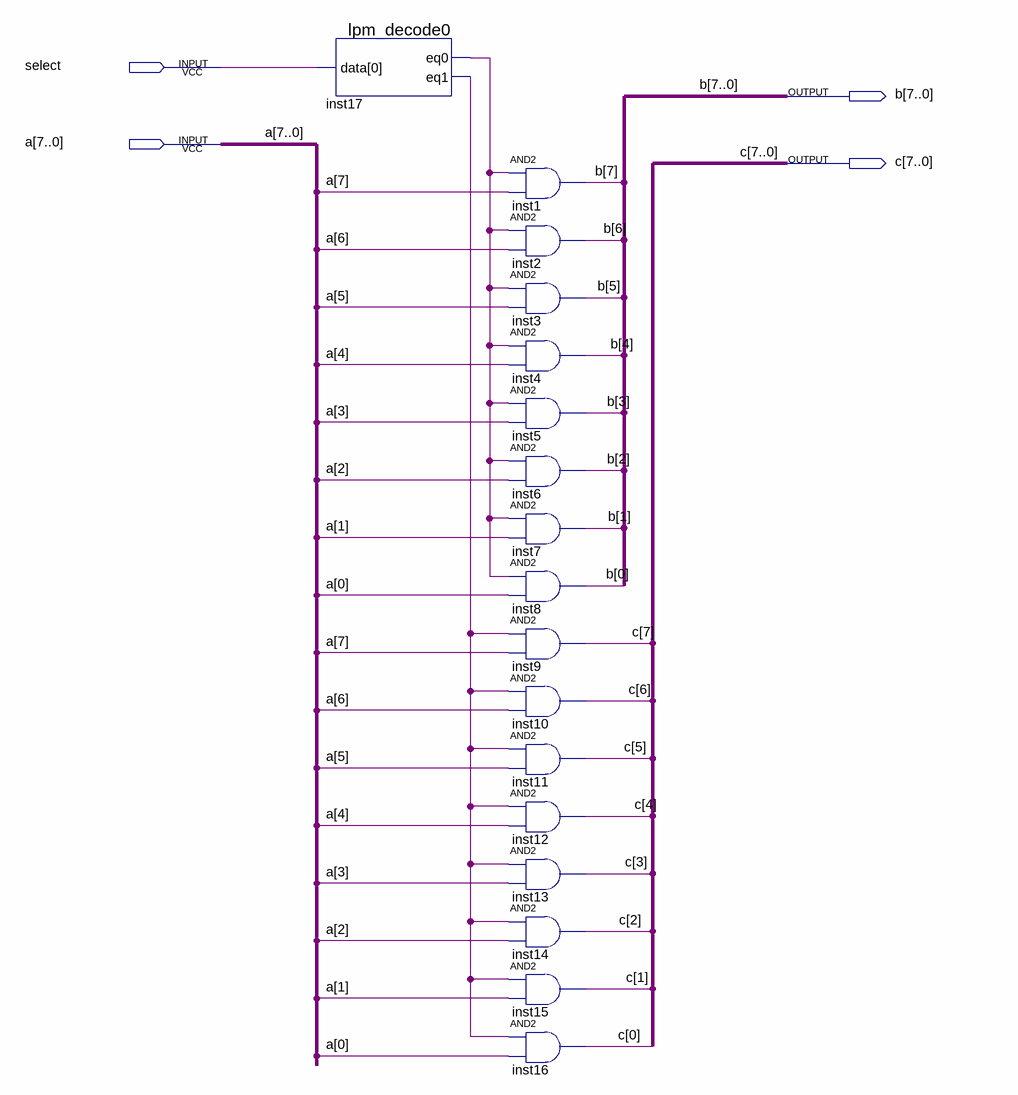
[diagram p0: schematic sheet]
// Quartus schematic demux.bdf as structural Verilog: 17 symbols, 4 pins
module demux (
  input  select,
  input  [7:0] a,
  output [7:0] b,
  output [7:0] c
);

  wire inst17_eq0, inst17_eq1;

  lpm_decode0 inst17 (.data(select), .eq0(inst17_eq0), .eq1(inst17_eq1));
  and inst1 (b[7], inst17_eq0, a[7]);
  and inst2 (b[6], inst17_eq0, a[6]);
  and inst3 (b[5], inst17_eq0, a[5]);
  and inst4 (b[4], inst17_eq0, a[4]);
  and inst5 (b[3], inst17_eq0, a[3]);
  and inst6 (b[2], inst17_eq0, a[2]);
  and inst7 (b[1], inst17_eq0, a[1]);
  and inst8 (b[0], inst17_eq0, a[0]);
  and inst9 (c[7], inst17_eq1, a[7]);
  and inst10 (c[6], inst17_eq1, a[6]);
  and inst11 (c[5], inst17_eq1, a[5]);
  and inst12 (c[4], inst17_eq1, a[4]);
  and inst13 (c[3], inst17_eq1, a[3]);
  and inst14 (c[2], inst17_eq1, a[2]);
  and inst15 (c[1], inst17_eq1, a[1]);
  and inst16 (c[0], inst17_eq1, a[0]);
endmodule
